# EAGLE design muse (EAGLE 7.5.0)
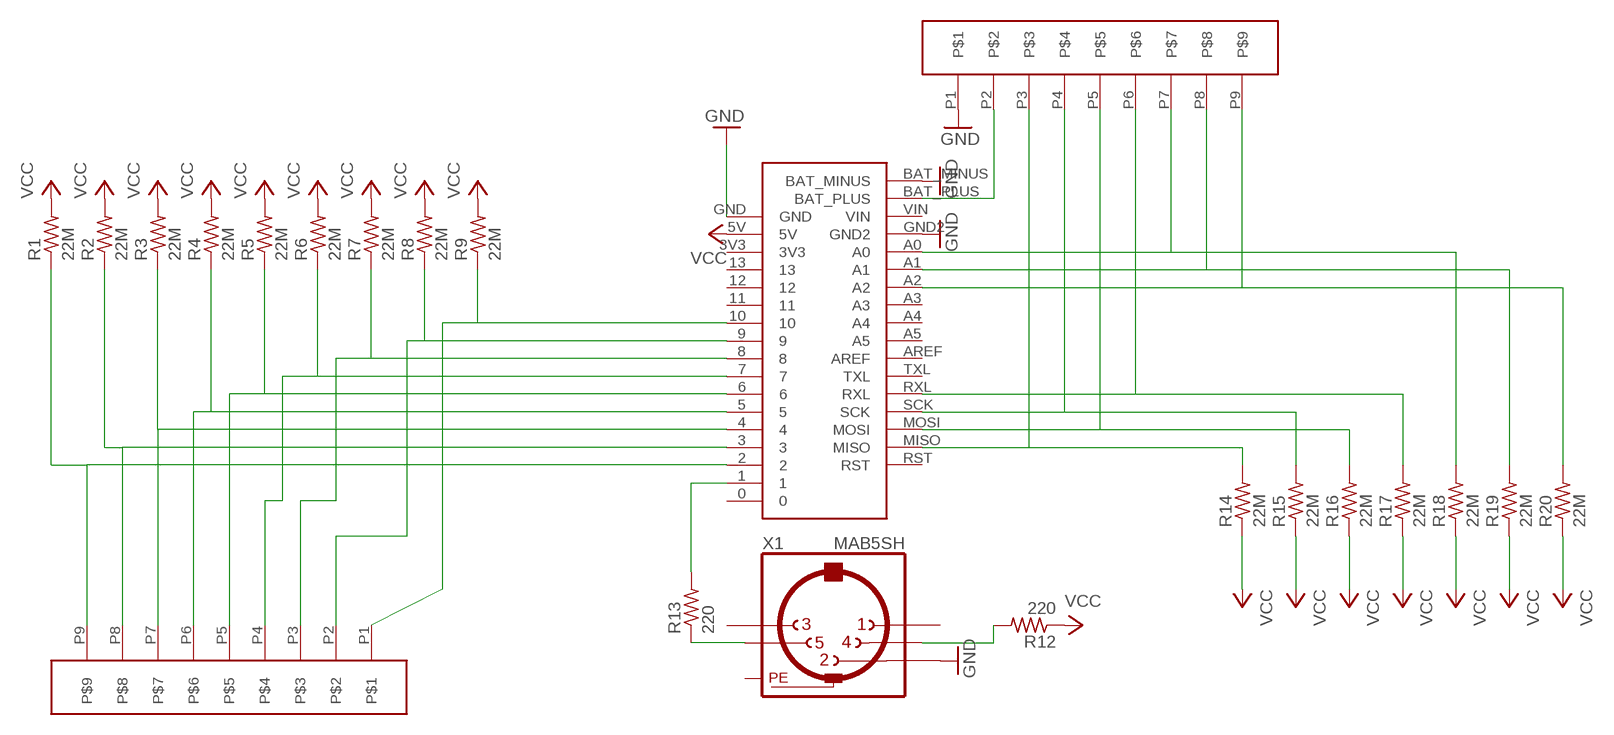
[diagram p0: schematic, sheet 1]

## Parts
R1  22M  R-US_0204/7  [0204/7]
R2  22M  R-US_0204/7  [0204/7]
R3  22M  R-US_0204/7  [0204/7]
R4  22M  R-US_0204/7  [0204/7]
R5  22M  R-US_0204/7  [0204/7]
R6  22M  R-US_0204/7  [0204/7]
R7  22M  R-US_0204/7  [0204/7]
R8  22M  R-US_0204/7  [0204/7]
R9  22M  R-US_0204/7  [0204/7]
R12  220  R-US_0204/7  [0204/7]
R13  220  R-US_0204/7  [0204/7]
R14  22M  R-US_0204/7  [0204/7]
R15  22M  R-US_0204/7  [0204/7]
R16  22M  R-US_0204/7  [0204/7]
R17  22M  R-US_0204/7  [0204/7]
R18  22M  R-US_0204/7  [0204/7]
R19  22M  R-US_0204/7  [0204/7]
R20  22M  R-US_0204/7  [0204/7]
U$1  POLOLU_A_STAR_32U4_MINI  [POLOLU_A_STAR_32U4_MINI]
U$2  3MM_1X9_CONNECTOR  [3MM_1X9_CONNECTOR]
U$3  3MM_1X9_CONNECTOR  [3MM_1X9_CONNECTOR]
X1  MAB5SH  [MAB5SH]

## Nets
GND: U$1.BAT_MINUS U$1.GND U$1.GND2 U$3.P1 X1.2
N$1: R1.1 U$1.2 U$2.P9
N$2: R2.1 U$1.3 U$2.P8
N$3: R3.1 U$1.4 U$2.P7
N$4: R4.1 U$1.5 U$2.P6
N$5: R5.1 U$1.6 U$2.P5
N$6: R6.1 U$1.7 U$2.P4
N$7: R7.1 U$1.8 U$2.P3
N$8: R8.1 U$1.9 U$2.P2
N$9: R9.1 U$1.10 U$2.P1
N$10: R12.2 X1.4
N$11: U$1.BAT_PLUS U$3.P2
N$13: R13.2 U$1.1
N$16: R13.1 X1.5
N$17: R14.2 U$1.MISO U$3.P3
N$18: R15.2 U$1.SCK U$3.P4
N$19: R16.2 U$1.MOSI U$3.P5
N$20: R17.2 U$1.RXL U$3.P6
N$21: R18.2 U$1.A0 U$3.P7
N$22: R19.2 U$1.A1 U$3.P8
N$23: R20.2 U$1.A2 U$3.P9
VCC: R1.2 R2.2 R3.2 R4.2 R5.2 R6.2 R7.2 R8.2 R9.2 R12.1 R14.1 R15.1 R16.1 R17.1 R18.1 R19.1 R20.1 U$1.5V
Unconnected: U$1.0 U$1.3V3 U$1.11 U$1.12 U$1.13 U$1.A3 U$1.A4 U$1.A5 U$1.AREF U$1.RST U$1.TXL U$1.VIN X1.1 X1.3

## Power pins joined to a net without a drawn wire
PE: X1.PE X1.PE@(PE)

## Library data of the parts
R1-R9 R12-R20 = resistor:R-US_: RESISTOR, American symbol
U$1 = pololu:POLOLU_A_STAR_32U4_MINI
U$2 U$3 = AllwineDesigns:3MM_1X9_CONNECTOR
X1 = con-hirschmann:MAB5SH: Female CONNECTOR 5 pins 90 deg. with shield, horizontal (DIN 41524); OC_FARNELL: 809883; OC_NEWARK: unknown

## Board
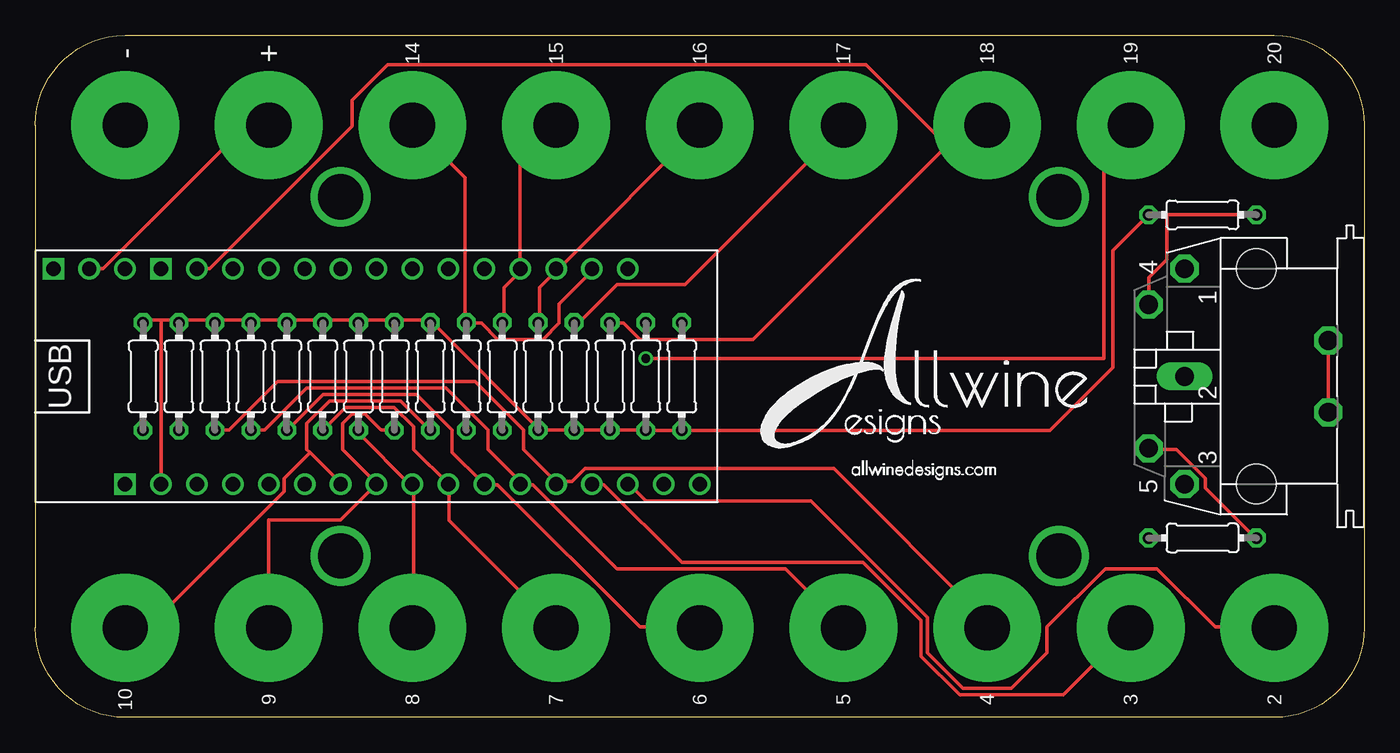
[diagram p1: board, top side]
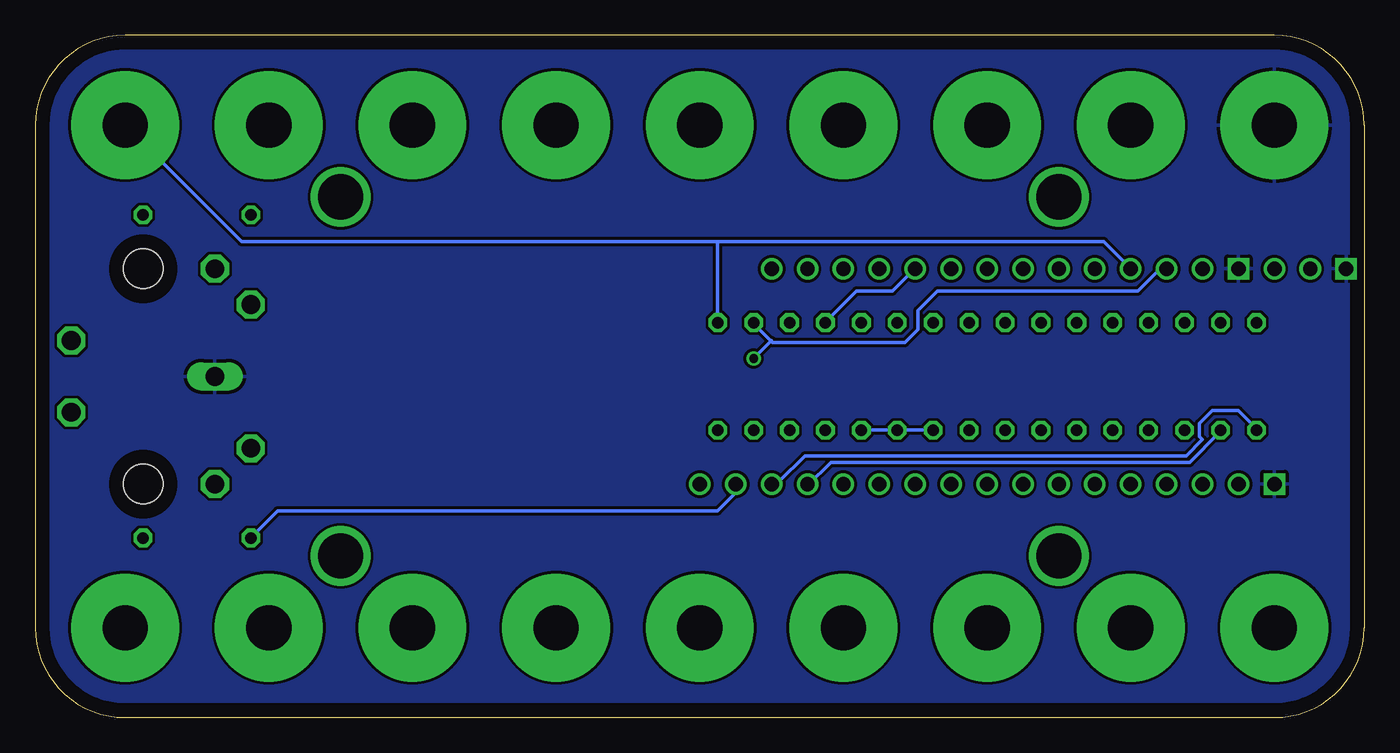
[diagram p2: board, bottom side, seen from below]

Size 93.98 x 48.26 mm. Coordinates in mm from the lower left corner, seen from the top.
Outline: 0,41.91 0,6.35 arc90 6.35,0 87.63,0 arc90 93.98,6.35 93.98,41.91 arc90 87.63,48.26 6.35,48.26 arc90 0,41.91
Copper layers (1*16): Top 0.035mm / dielectric 1.5mm / Bottom 0.035mm
Design rules "default": minimum track width 10mil, minimum drill 24mil, track to track 8mil, track to pad 8mil, pad to pad 8mil, via to via 8mil, smd to smd 8mil, copper to edge 40mil, drill to drill 8mil, minimum pad ring 10mil, minimum via ring 8mil, stop-mask expansion 4mil, vias tented up to drill 0mil, thermal gap 10mil

### Footprints (pad centres in the part's own frame; a part is rotated, then mirrored left to right if it is on the bottom)
0204/7 = drill 0.813 octagon: 1 -3.81,0; 2 3.81,0
POLOLU_A_STAR_32U4_MINI = drill 1.016: 0 1.27,1.27; 1 1.27,3.81; 2 1.27,6.35; 3 1.27,8.89; 3V3 1.27,36.83; 4 1.27,11.43; 5 1.27,13.97; 5V 1.27,39.37; 6 1.27,16.51; 7 1.27,19.05; 8 1.27,21.59; 9 1.27,24.13; 10 1.27,26.67; 11 1.27,29.21; 12 1.27,31.75; 13 1.27,34.29; A0 16.51,36.83; A1 16.51,34.29; A2 16.51,31.75; A3 16.51,29.21; A4 16.51,26.67; A5 16.51,24.13; AREF 16.51,21.59; BAT_PLUS 16.51,44.45; MISO 16.51,8.89; MOSI 16.51,11.43; RST 16.51,6.35; RXL 16.51,16.51; SCK 16.51,13.97; TXL 16.51,19.05; VIN 16.51,41.91 | drill 1.016 square: BAT_MINUS 16.51,46.99; GND 1.27,41.91; GND2 16.51,39.37
3MM_1X9_CONNECTOR = drill 3.2 pad 7.62: P1 -40.64,0; P2 -30.48,0; P3 -20.32,0; P4 -10.16,0; P5 0,0; P6 10.16,0; P7 20.32,0; P8 30.48,0; P9 40.64,0
MAB5SH = drill 1.321 octagon: 1 7.62,5.08; 3 -7.62,5.08; 4 5.08,7.62; 5 -5.08,7.62; PE -2.54,-5.08; PE@ 2.54,-5.08 | drill 1.321 long: 2 0,5.08 | hole 2.794: 7.62,0; -7.62,0

### Placement (x,y rotation side)
R1  7.62,24.13 90 top
R2  10.16,24.13 90 top
R3  12.7,24.13 90 top
R4  15.24,24.13 90 top
R5  17.78,24.13 90 top
R6  20.32,24.13 90 top
R7  22.86,24.13 90 top
R8  25.4,24.13 90 top
R9  27.94,24.13 90 top
R12  82.55,35.56 0 top
R13  82.55,12.7 180 top
R14  30.48,24.13 90 top
R15  33.02,24.13 90 top
R16  35.56,24.13 90 top
R17  38.1,24.13 90 top
R18  40.64,24.13 90 top
R19  43.18,24.13 90 top
R20  45.72,24.13 90 top
U$1  48.26,15.24 90 top
U$2  46.99,6.35 0 top
U$3  46.99,41.91 0 top
X1  86.36,24.13 90 top

### Tracks (layer width: path | path; a pad name or v marks a point on that pad's centre or on a via)
GND
  pour Bottom: -1.27,49.53 -1.27,-1.27 95.25,-1.27 95.25,49.53
N$1
  Top 0.254: U$2.P9 87.55,6.4 83.44,6.4 79.32,10.52 75.67,10.52 71.55,6.4 71.55,4.57 69.04,2.06 65.61,2.06 63.09,4.57 63.09,7.09 54.86,15.32 43.2,15.32 42.06,16.46 U$1.2
  Bottom 0.254: R1.1 7.77,20.34 7.77,20.57 8.91,21.72 10.74,21.72 11.66,20.8 11.66,19.89 11.43,19.66 12.57,18.52 39.55,18.52 41.38,16.69 41.83,16.69 U$1.2
N$2
  Top 0.254: U$1.3 39.55,16.46 40.23,16.46 45.72,10.97 58.52,10.97 62.64,6.86 62.64,4.34 65.38,1.6 72.69,1.6 77.27,6.17 U$2.P8
  Bottom 0.254: R2.1 10.29,20.12 12.34,18.06 37.72,18.06 39.32,16.46 U$1.3
N$3
  Top 0.254: R3.1 12.8,20.34 13.72,20.34 17.14,23.77 31.09,23.77 34.52,20.34 34.52,18.97 36.8,16.69 U$1.4 37.03,16.69 37.95,16.69 38.86,17.6 56.46,17.6 67.21,6.86 67.21,6.4 U$2.P7
N$4
  Top 0.254: R4.1 15.32,20.34 16.23,20.34 19.2,23.32 29.03,23.32 32,20.34 32,18.97 34.29,16.69 U$1.5 34.29,16.46 35.2,16.46 41.15,10.52 53.03,10.52 57.15,6.4 U$2.P6
N$5
  Top 0.254: R5.1 17.83,20.34 20.34,22.86 26.98,22.86 29.49,20.34 29.49,18.75 31.55,16.69 U$1.6 31.77,16.46 32.69,16.46 42.75,6.4 46.86,6.4 U$2.P5
N$6
  Top 0.254: R6.1 21.95,21.95 25.38,21.95 26.75,20.57 26.75,18.97 U$1.7 29.26,16.46 29.26,13.95 36.8,6.4 U$2.P4
N$7
  Top 0.254: R7.1 22.86,20.12 26.52,16.46 U$1.8 26.75,16.46 26.75,6.4 U$2.P3
N$8
  Top 0.254: R8.1 25.38,20.34 24.46,20.34 23.32,21.49 22.4,21.49 21.72,20.8 21.72,18.97 24,16.69 U$1.9 21.59,13.97 16.51,13.97 U$2.P2
N$9
  Top 0.254: 19.43,18.75 21.49,16.69 U$1.10 | 19.43,18.75 19.2,18.97 19.2,20.8 20.8,22.4 25.83,22.4 27.89,20.34 R9.1 | 19.43,18.75 17.6,16.92 17.6,16 8,6.4 6.4,6.4 U$2.P1
N$10
  Top 0.254: R12.2 80.01,35.56 80.01,32.38 78.74,31.11 X1.4
N$11
  Top 0.254: U$1.BAT_PLUS 3.89,31.77 4.8,31.77 14.86,41.83 16.46,41.83 U$3.P2
N$12  (via drill 3.2)
  other vias: 21.59,36.83
N$13
  Bottom 0.254: R13.2 76.83,14.61 45.72,14.61 44.45,15.88 U$1.1
N$14  (via drill 3.2)
  other vias: 21.59,11.43
N$15  (via drill 3.2)
  other vias: 72.39,11.43
N$16
  Top 0.254: R13.1 86.18,12.8 82.75,16.23 82.75,16.92 80.7,18.97 78.87,18.97 X1.5
N$17
  Top 0.254: U$1.MISO 39.32,31.55 37.03,29.26 37.03,27.89 35.89,26.75 32.69,26.75 31.55,27.89 30.63,27.89 R14.2 30.4,28.12 30.4,38.18 U$3.P3
N$18
  Top 0.254: R15.2 33.15,28.12 33.15,30.4 34.29,31.55 U$1.SCK 34.29,39.32 36.8,41.83 U$3.P4
N$19
  Top 0.254: R16.2 35.66,28.12 35.66,30.4 36.8,31.55 U$1.MOSI 37.03,31.77 47.09,41.83 U$3.P5
N$20
  Top 0.254: R17.2 38.18,28.12 38.63,28.12 41.15,30.63 45.95,30.63 57.15,41.83 U$3.P6
  Bottom 0.254: R17.2 37.95,28.12 35.89,30.18 33.38,30.18 31.77,31.77 U$1.RXL
N$21
  Top 0.254: 64.47,40.46 65.84,41.83 67.21,41.83 U$3.P7 64.47,40.46 | 64.47,40.46 50.75,26.75 42.75,26.75 41.6,27.89 40.69,27.89 R18.2 | 64.47,40.46 58.75,46.18 24.92,46.18 22.4,43.66 22.4,41.83 12.34,31.77 11.43,31.77 U$1.A0
N$22  (via drill 0.61)
  Top 0.254: v43.18,25.4 75.56,25.4 75.56,40.01 U$3.P8
  Bottom 0.254: 41.95,26.63 41.83,26.52 32.46,26.52 31.55,27.43 31.55,28.8 30.18,30.18 16,30.18 14.63,31.55 14.17,31.55 U$1.A1 | 41.95,26.63 42.98,27.66 42.98,27.89 R19.2 | v43.18,25.4 41.95,26.63 | 41.91,26.67 41.95,26.63
N$23
  Bottom 0.254: 45.72,33.66 R20.2 | 45.72,33.66 18.41,33.66 U$1.A2 | 45.72,33.66 79.38,33.66 U$3.P9
N$24  (via drill 3.2)
  other vias: 72.39,36.83
PE
  Top 0.254: X1.PE@ X1.PE
VCC
  Top 0.254: 22.86,28.12 20.34,28.12 R6.2 20.12,28.12 17.83,28.12 R5.2 17.6,28.12 15.32,28.12 R4.2 15.09,28.12 12.8,28.12 R3.2 12.57,28.12 10.29,28.12 R2.2 10.06,28.12 8.91,28.12 | 22.86,28.12 25.38,28.12 R8.2 25.6,28.12 27.89,28.12 R9.2 28.12,27.89 35.66,20.34 | 22.86,28.12 R7.2 | 8.91,28.12 7.77,28.12 R1.2 | 8.91,28.12 8.91,16.69 U$1.5V | 35.66,20.34 37.95,20.34 R17.1 38.18,20.34 40.46,20.34 R18.1 40.69,20.34 42.98,20.34 R19.1 R20.1 71.75,20.32 76.2,24.77 76.2,33.02 R12.1 | 35.66,20.34 R16.1
  Bottom 0.254: R14.1 30.63,20.34 32.92,20.34 R15.1 33.15,20.34 35.43,20.34 R16.1

### Text on the board
tPlace: - | + | 14 | 15 | 16 | 17 | 18 | 19 | 20 | USB | 10 | 9 | 8 | 7 | 6 | 5 | 4 | 3 | 2